# EAGLE schematic PCB-ARD-BOS2 (EAGLE 6.5.0)
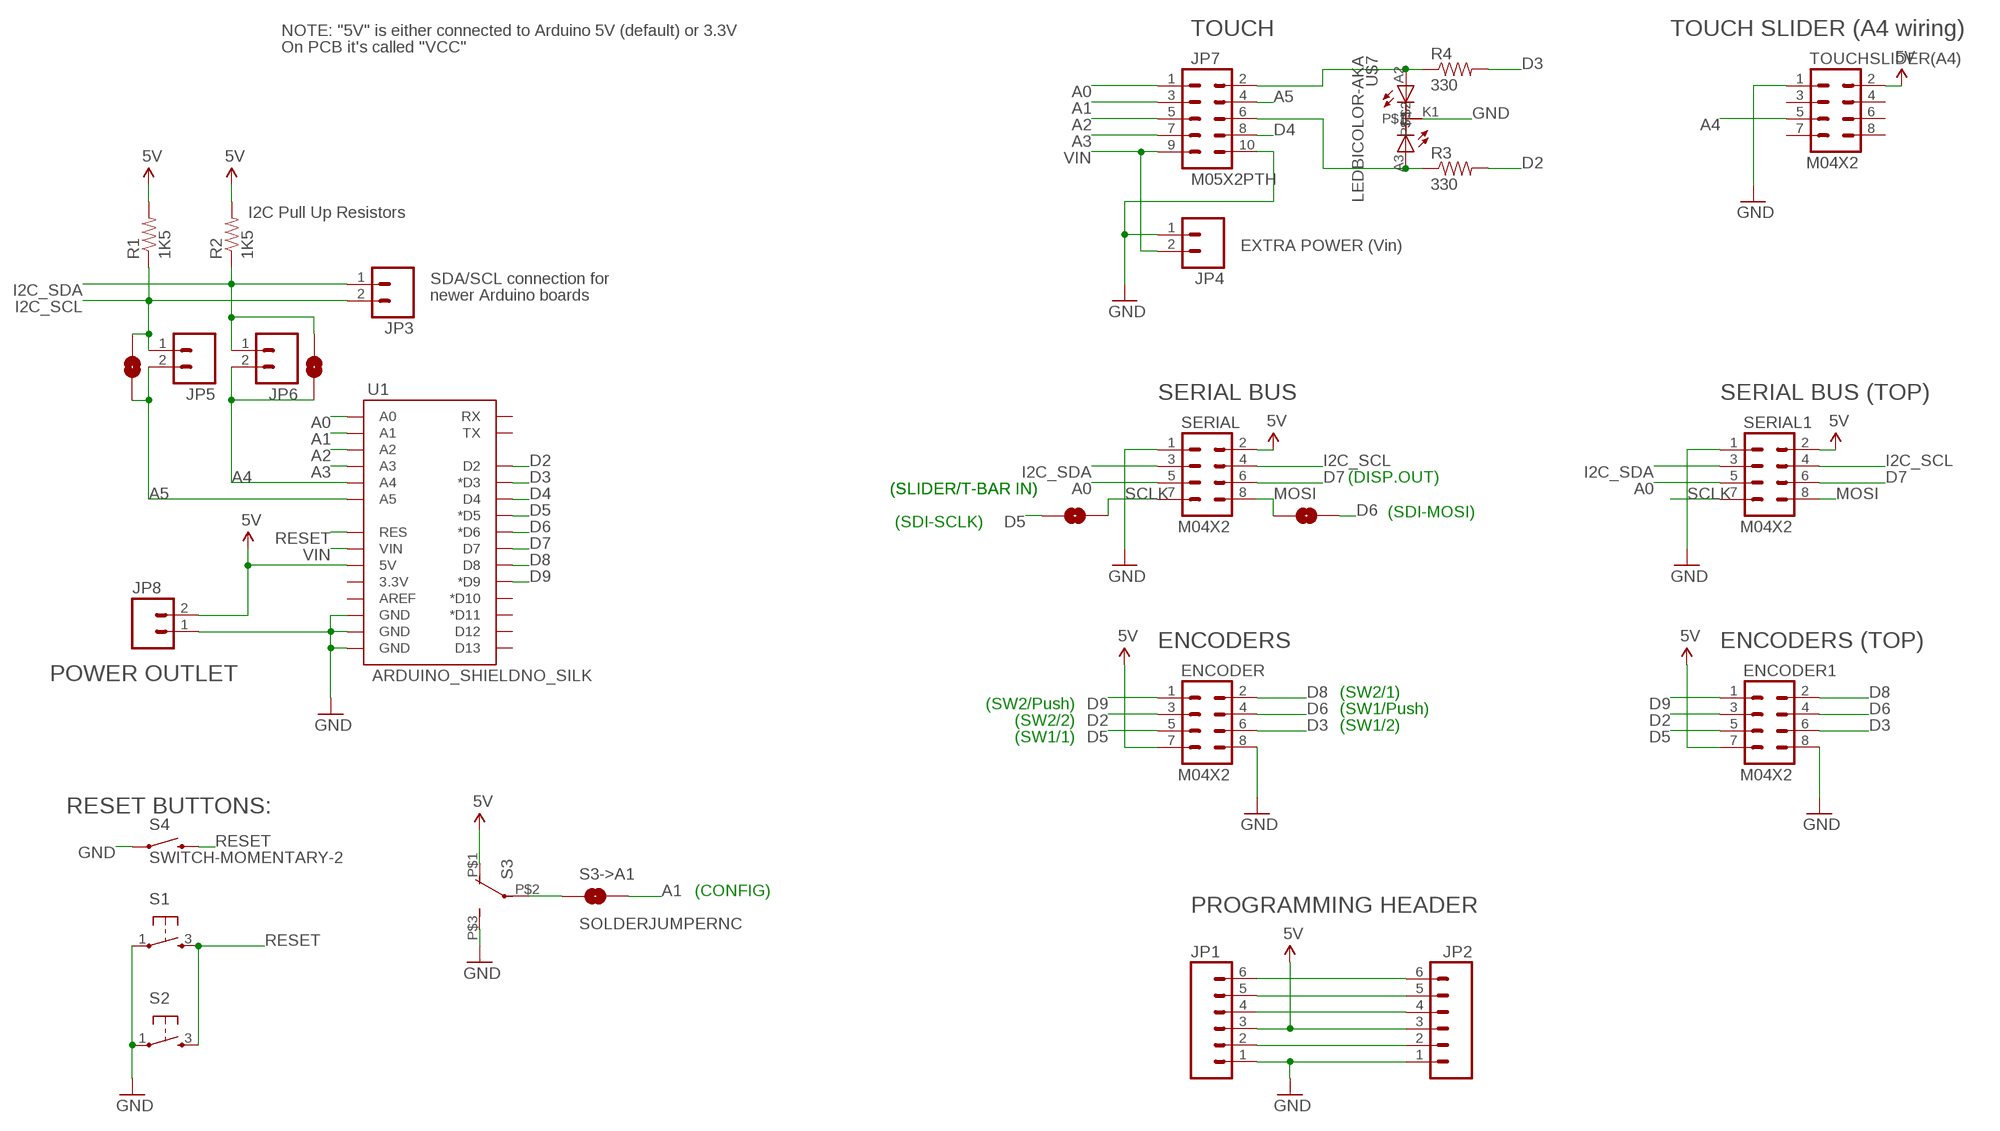
[diagram p0: schematic, sheet 1]

## Parts
ENCODER  M04X2  [2X4]
ENCODER1  M04X2  [2X4]
JP1  M06POLAR  [MOLEX-1X6]
JP2  M06POLAR  [MOLEX-1X6]
JP3  M02PTH  [1X02]
JP4  M02PTH  [1X02]
JP5  M02PTH  [1X02]
JP6  M02PTH  [1X02]
JP7  M05X2PTH  [AVR_ICSP]
JP8  M02PTH4  [1X02_XTRA_BIG]
MOSI->D6  SOLDERJUMPERNC  [SJ_2S]
R1  1K5  RESISTOR0603-RES  [0603-RES]
R2  1K5  RESISTOR0603-RES  [0603-RES]
R3  330  RESISTORPTH-1/4W  [AXIAL-0.4]
R4  330  RESISTORPTH-1/4W  [AXIAL-0.4]
S1  TAC_SWITCH  [PUSHBUTTON]
S2  TAC_SWITCH  [PUSHBUTTON]
S3  SWITCH-DPST  [TECONNECTIVITY-DPST]
S3->A1  SOLDERJUMPERNC  [SJ_2S]
S3->A2  SOLDERJUMPERNC  [SJ_2S]
S3->A3  SOLDERJUMPERNC  [SJ_2S]
S4  SWITCH-MOMENTARY-2  [TACTILE_SWITCH_TALL]
SCLK->D5  SOLDERJUMPERNC  [SJ_2S]
SERIAL  M04X2  [2X4]
SERIAL1  M04X2  [2X4]
TOUCHSLIDER(A4)  M04X2  [2X4]
U1  ARDUINO_SHIELDNO_SILK  [DUEMILANOVE_VIAS]
U$7  LEDBICOLOR-AKA  [LED5MM-BICOLOR]

## Nets
5V [Power]: ENCODER1.7 ENCODER.7 JP1.3 JP2.3 JP8.2 R1.2 R2.2 S3.P$1(O) SERIAL1.2 SERIAL.2 TOUCHSLIDER(A4).2 U1.5V
A0: JP7.1 SERIAL1.5 SERIAL.5 U1.A0
A1: JP7.3 S3->A1.2 U1.A1
A2: JP7.5 U1.A2
A3: JP7.7 U1.A3
A4: JP6.2 S3->A3.2 TOUCHSLIDER(A4).5 U1.A4
A5: JP5.2 JP7.4 S3->A2.2 U1.A5
D2: ENCODER1.3 ENCODER.3 R3.P$2 U1.D2
D3: ENCODER1.6 ENCODER.6 R4.P$2 U1.D3(*D3)
D4: JP7.8 U1.D4
D5: ENCODER1.5 ENCODER.5 SCLK->D5.1 U1.D5(*D5)
D6: ENCODER1.4 ENCODER.4 MOSI->D6.2 U1.D6(*D6)
D7: SERIAL1.6 SERIAL.6 U1.D7
D8: ENCODER1.2 ENCODER.2 U1.D8
D9: ENCODER1.1 ENCODER.1 U1.D9(*D9)
GND [Power]: ENCODER1.8 ENCODER.8 JP1.1 JP2.1 JP4.1 JP7.10 JP8.1 S1.1 S2.1 S3.P$3(S) S4.A2 SERIAL1.1 SERIAL.1 TOUCHSLIDER(A4).1 U1.GND@0(GND) U1.GND@1(GND) U1.GND@2(GND) U$7.K1
I2C_SCL: JP3.2 JP5.1 R1.1 S3->A2.1 SERIAL1.4 SERIAL.4
I2C_SDA: JP3.1 JP6.1 R2.1 S3->A3.1 SERIAL1.3 SERIAL.3
MOSI: MOSI->D6.1 SERIAL1.8 SERIAL.8
N$1: JP1.2 JP2.2
N$2: S3->A1.1 S3.P$2(P)
N$7: JP7.2 R4.P$1 U$7.A2
N$8: JP7.6 R3.P$1 U$7.A3
N$33: JP1.4 JP2.4
N$34: JP1.5 JP2.5
N$45: JP1.6 JP2.6
RESET: S1.3 S2.3 S4.B2 U1.RES
SCLK: SCLK->D5.2 SERIAL1.7 SERIAL.7
VIN [Power]: JP4.2 JP7.9 U1.VIN
Unconnected: TOUCHSLIDER(A4).3 TOUCHSLIDER(A4).4 TOUCHSLIDER(A4).6 TOUCHSLIDER(A4).7 TOUCHSLIDER(A4).8 U1.3.3V U1.AREF U1.D10(*D10) U1.D11(*D11) U1.D12 U1.D13 U1.RX U1.TX

## Notes on the sheet
- NOTE: "5V" is either connected to Arduino 5V (default) or 3.3V | TOUCH | TOUCH SLIDER (A4 wiring)
- On PCB it's called "VCC"
- I2C Pull Up Resistors
- EXTRA POWER (Vin)
- SDA/SCL connection for
- newer Arduino boards
- SERIAL BUS | SERIAL BUS (TOP)
- (DISP.OUT)
- (SLIDER/T-BAR IN) | (SLIDER/T-BAR IN)
- (SDI-MOSI)
- (SDI-SCLK)
- ENCODERS | ENCODERS (TOP)
- POWER OUTLET
- (SW2/Push) | (SW2/1)
- (SW2/2) | (SW1/Push)
- (SW1/1) | (SW1/2)
- RESET BUTTONS:
- (CONFIG)
- PROGRAMMING HEADER

## Library data of the parts
ENCODER ENCODER1 SERIAL SERIAL1 TOUCHSLIDER(A4) = SparkFun:M04X2
JP1 JP2 = SparkFun:M06: Header 6 Standard 6-pin 0.1" header. Use with straight break away headers (SKU : PRT-00116), right angle break away headers (PRT-00553), swiss pins (PRT-00743), machine pins (PRT-00117), and female headers (PRT-00115). Molex polarized connector foot print use with SKU : PRT-08094 with associated crimp pins and housings. NOTES ON THE VARIANTS LOCK and LOCK_LONGPADS... This footprint was designed to help hold the alignment of a through-hole component (i.e. 6-pin header) while soldering it into place. You may notice that each hole has been shifted either up or down by 0.005 of an inch from it's more standard position (which is a perfectly straight line). This slight alteration caused the pins (the squares in the middle) to touch the edges of the holes. Because they are alternating, it causes a "brace" to hold the component in place. 0.005 has proven to be the perfect amount of "off-center" position when using our standard breakaway headers. Although looks a little odd when you look at the bare footprint, once you have a header in there, the alteration is very hard to notice. Also, if you push a header all the way into place, it is covered up entirely on the bottom side. This idea of altering the position of holes to aid alignment will be further integrated into the Sparkfun Library for other footprints. It can help hold any component with 3 or more connection pins.
JP3-JP6 JP8 = SparkFun:M02: Header 2 Standard 2-pin 0.1" header. Use with straight break away headers (SKU : PRT-00116), right angle break away headers (PRT-00553), swiss pins (PRT-00743), machine pins (PRT-00117), and female headers (PRT-00115). Molex polarized connector foot print use with SKU : PRT-08233 with associated crimp pins and housings.
JP7 = SparkFun:M05X2: Header 5x2 Standard 10-pin dual row 0.1" header. Commonly used with AVR-ISP. Use with Spark Fun Electronics SKU: PRT-00778
MOSI->D6 S3->A1-S3->A3 SCLK->D5 = SparkFun:SOLDERJUMPER: Solder Jumper Standard SMD solder jumper. Used to automate production. Two varients : Normally Open and Normally Closed are the same, but have different paste layers. NC will have a large amount of paste and should jumper during reflow.
R1-R4 = SparkFun:RESISTOR: Resistor Basic schematic elements and footprints for 0603, 1206, and PTH resistors.
S1 S2 = SKAARHOJ:TAC_SWITCH: Momentary Switch Button commonly used for reset or general input. Spark Fun Electronics SKU : COM-00097
S3 = SKAARHOJ:SWITCH-DPST: DPDT Version of the COM-00597
S4 = SparkFun:SWITCH-MOMENTARY-2
U1 = SparkFun:ARDUINO_SHIELD
U$7 = SKAARHOJ:LEDBICOLOR-AKA

## Net classes
0 default: width 0.203 mm, drill 0.61 mm, clearance 0.203 mm
1 Power: width 0.406 mm, drill 0.61 mm, clearance 0.305 mm